# EAGLE design Xbee extension (EAGLE 9.6.2)
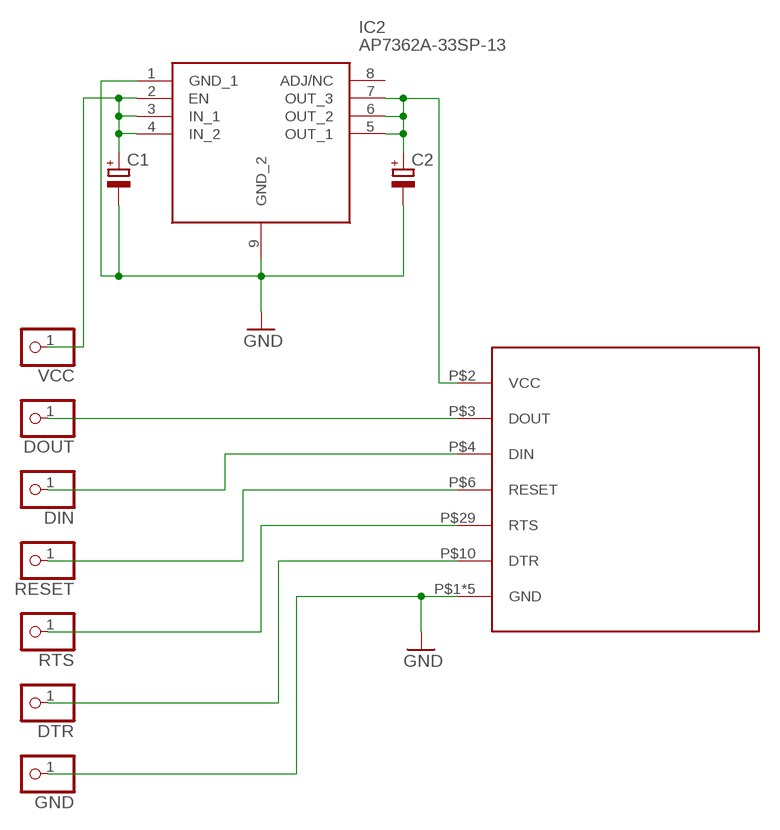
[diagram p0: schematic, sheet 1]

## Parts
C1  CPOL-EU153CLV-0605  [153CLV-0605]
C2  CPOL-EU153CLV-0605  [153CLV-0605]
DIN  PINHD-1X1  [1X01]
DOUT  PINHD-1X1  [1X01]
DTR  PINHD-1X1  [1X01]
GND  PINHD-1X1  [1X01]
IC2  AP7362A-33SP-13  [SOIC127P600X150-9N]
RESET  PINHD-1X1  [1X01]
RTS  PINHD-1X1  [1X01]
U$1  PRO_XTC  [PRO_XTC]
VCC  PINHD-1X1  [1X01]

## Nets
GND: C1.- C2.- GND.1 IC2.1(GND_1) IC2.9(GND_2) U$1.P$1(GND) U$1.P$11(GND) U$1.P$13(GND) U$1.P$22(GND) U$1.P$35(GND)
N$1: C1.+ IC2.2(EN) IC2.3(IN_1) IC2.4(IN_2) VCC.1
N$2: DOUT.1 U$1.P$3(DOUT)
N$3: DIN.1 U$1.P$4(DIN)
N$4: RESET.1 U$1.P$6(RESET)
N$5: RTS.1 U$1.P$29(RTS)
N$6: DTR.1 U$1.P$10(DTR)
N$8: C2.+ IC2.5(OUT_1) IC2.6(OUT_2) IC2.7(OUT_3) U$1.P$2(VCC)
Unconnected: IC2.8(ADJ/NC)

## Library data of the parts
C1 C2 = rcl:CPOL-EU: POLARIZED CAPACITOR, European symbol; SPICEPREFIX: C
DIN DOUT DTR GND RESET RTS VCC = pinhead:PINHD-1X1: PIN HEADER
IC2 = SamacSys_Parts:AP7362A-33SP-13: LDO Voltage Regulators LDO CMOS HiCurr SO-8 1.5A LowQ Adj 190mV Source: Datasheet <https://www.diodes.com/assets/Datasheets/AP7362.pdf>; DESCRIPTION: LDO Voltage Regulators LDO CMOS HiCurr SO-8 1.5A LowQ Adj 190mV; HEIGHT: 1.5mm; MANUFACTURER_NAME: Diodes Inc.; MANUFACTURER_PART_NUMBER: AP7362A-33SP-13; MOUSER_PART_NUMBER: 621-AP7362A-33SP-13; MOUSER_PRICE-STOCK: https://www.mouser.co.uk/ProductDetail/Diodes-Incorporated/AP7362A-33SP-13?qs=M%2FOdCRO8QQ3CiX1oDLy5Bg%3D%3D
U$1 = XBee:PRO_XTC

## Board
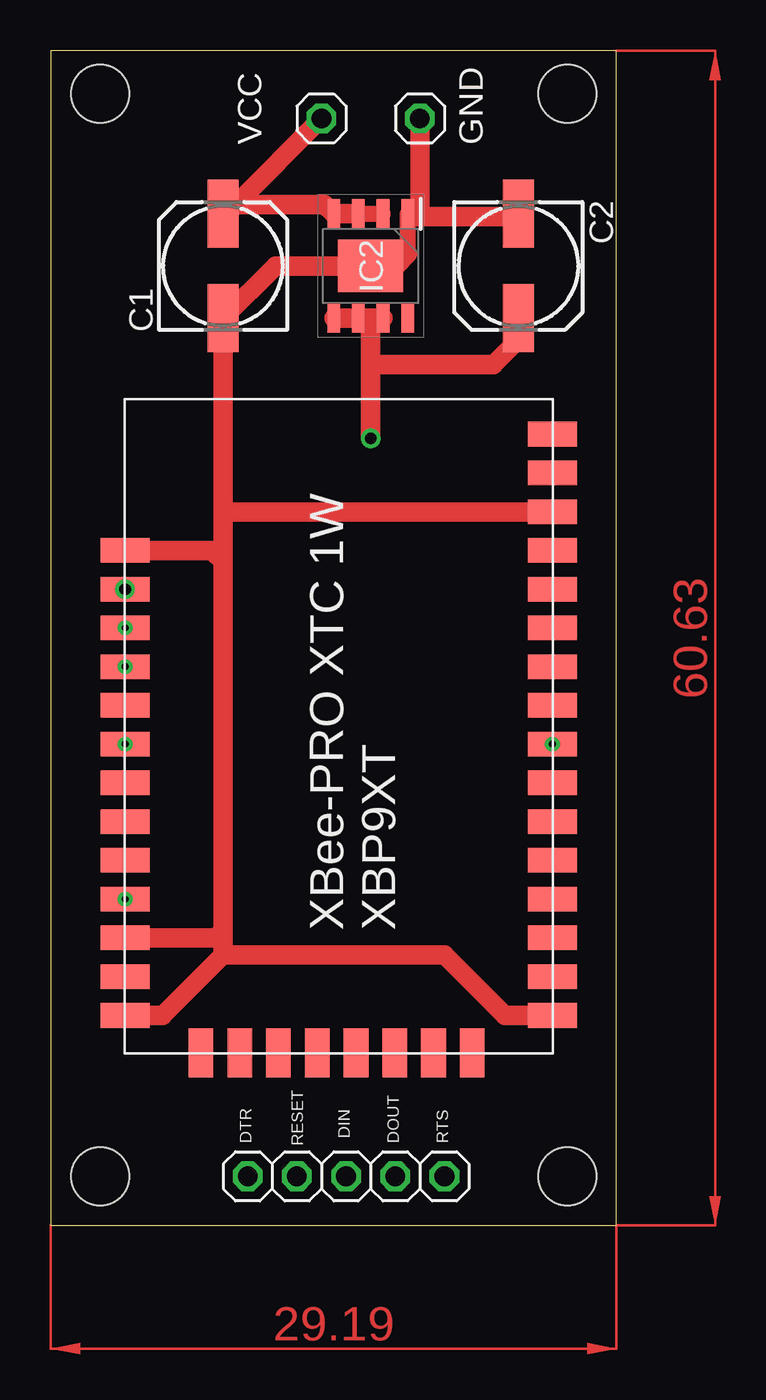
[diagram p1: board, top side]
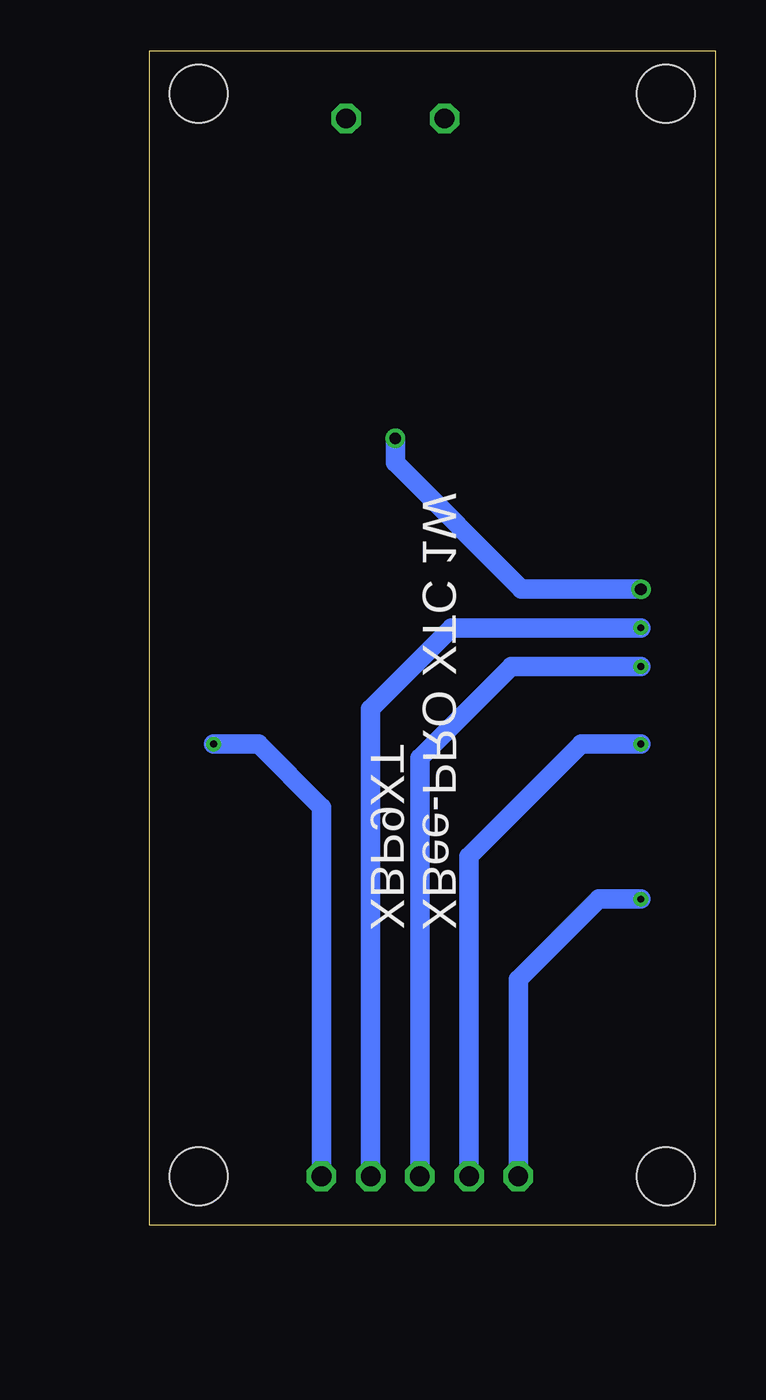
[diagram p2: board, bottom side, seen from below]

Size 29.19 x 60.63 mm. Coordinates in mm from the lower left corner, seen from the top.
Outline: 0,0 29.19,0 29.19,60.63 0,60.63 0,0
Copper layers (1*16): Top 0.035mm / dielectric 1.5mm / Bottom 0.035mm
Design rules "default": minimum track width 6mil, minimum drill 0.35mm, track to track 6mil, track to pad 6mil, pad to pad 6mil, via to via 6mil, smd to smd 6mil, copper to edge 40mil, drill to drill 6mil, minimum pad ring 10mil, minimum via ring 8mil, stop-mask expansion 4mil, vias tented up to drill 0mil, thermal gap 10mil
Holes 3 mm at 2.54,58.42 2.54,2.54 26.67,2.54 26.67,58.42

### Footprints (pad centres in the part's own frame; a part is rotated, then mirrored left to right if it is on the bottom)
153CLV-0605 = smd 3.5 x 1.6: + 2.7,0; - -2.7,0
1X01 = drill 1.016 octagon: 1 0,0
SOIC127P600X150-9N = smd 1.525 x 0.65: 1 -2.688,1.905; 2 -2.688,0.635; 3 -2.688,-0.635; 4 -2.688,-1.905; 5 2.688,-1.905; 6 2.688,-0.635; 7 2.688,0.635; 8 2.688,1.905 | smd 2.71 x 3.35: 9 0,0
PRO_XTC = smd 2.54 x 1.27: P$1 0.02,25.96; P$2 0.02,23.96; P$3 0.02,21.96; P$4 0.02,19.96; P$5 0.02,17.96; P$6 0.02,15.96; P$7 0.02,13.96; P$8 0.02,11.96; P$9 0.02,9.96; P$10 0.02,7.96; P$11 0.02,5.96; P$12 0.02,3.96; P$13 0.02,1.96; P$22 22.08,1.96; P$23 22.08,3.96; P$24 22.08,5.96; P$25 22.08,7.96; P$26 22.08,9.96; P$27 22.08,11.96; P$28 22.08,13.96; P$29 22.08,15.96; P$30 22.08,17.96; P$31 22.08,19.96; P$32 22.08,21.96; P$33 22.08,23.96; P$34 22.08,25.96; P$35 22.08,27.96; P$36 22.08,29.96; P$37 22.08,31.96 | smd 1.27 x 2.54: P$14 3.94,0.02; P$15 5.94,0.02; P$16 7.94,0.02; P$17 9.94,0.02; P$18 11.94,0.02; P$19 13.94,0.02; P$20 15.94,0.02; P$21 17.94,0.02

### Placement (x,y rotation side)
C1  8.89,49.53 90 top
C2  24.13,49.53 270 top
DIN  15.24,2.54 0 top
DOUT  17.78,2.54 0 top
DTR  10.16,2.54 0 top
GND  19.05,57.15 0 top
IC2  16.51,49.53 270 top
RESET  12.7,2.54 0 top
RTS  20.32,2.54 0 top
U$1  3.81,8.89 0 top
VCC  13.97,57.15 0 top

### Tracks (layer width: path | path; a pad name or v marks a point on that pad's centre or on a via)
GND
  Top 0.813: 18.41,50.16 IC2.1 18.9,52.22 19.05,52.07
  Top 1.016: GND.1 19.05,52.07 | 19.05,52.07 18.56,52.07 | 18.41,50.16 17.78,49.53 IC2.9 11.59,49.53 C1.- 8.89,36.83 | C2.- 23.97,52.07 19.05,52.07 | U$1.P$1 8.33,34.85 8.89,34.29 | 8.89,34.29 8.89,36.83 | 8.89,34.29 8.89,15.24 | 8.89,15.24 8.89,13.97 | U$1.P$13 5.77,10.85 8.89,13.97 | U$1.P$22 23.44,10.85 20.32,13.97 8.89,13.97 | U$1.P$11 8.5,14.85 8.89,15.24 | U$1.P$35 25.87,36.83 8.89,36.83
N$1
  Top 0.813: IC2.3 IC2.2
  Top 1.016: VCC.1 9.53,52.7 | 9.53,52.7 9.05,52.23 C1.+ | 9.53,52.7 14.12,52.7 IC2.4 IC2.3
N$2  (via drill 0.35)
  Bottom 1.016: DOUT.1 17.78,26.67 13.6,30.85 U$1.P$3
  other vias: 3.83,30.85
N$3  (via drill 0.35)
  Bottom 1.016: DIN.1 15.24,24.13 10.52,28.85 U$1.P$4
  other vias: 3.83,28.85
N$4  (via drill 0.35)
  Bottom 1.016: RESET.1 12.7,19.05 6.9,24.85 U$1.P$6
  other vias: 3.83,24.85
N$5  (via drill 0.35)
  Bottom 1.016: RTS.1 20.32,21.59 23.58,24.85 U$1.P$29
  other vias: 25.89,24.85
N$6  (via drill 0.35)
  Bottom 1.016: DTR.1 10.16,12.7 6.01,16.85 U$1.P$10
  other vias: 3.83,16.85
N$8  (via drill 0.6)
  Top 1.016: IC2.7 16.51,46.84 | 16.51,46.84 IC2.6 IC2.5 | 16.51,46.84 16.51,44.45 | 16.51,44.45 22.86,44.45 24.13,45.72 C2.+ | 16.51,44.45 v16.51,40.64
  Bottom 1.016: v16.51,40.64 16.51,39.37 9.99,32.85 U$1.P$2
  other vias: 3.83,32.85
(copper drawn outside any net)
  shapes: Top area x2

### Text on the board
tNames: XBee-PRO XTC 1W / XBP9XT
bNames: XBee-PRO XTC 1W / XBP9XT